# EAGLE design matemat (EAGLE 5.10)
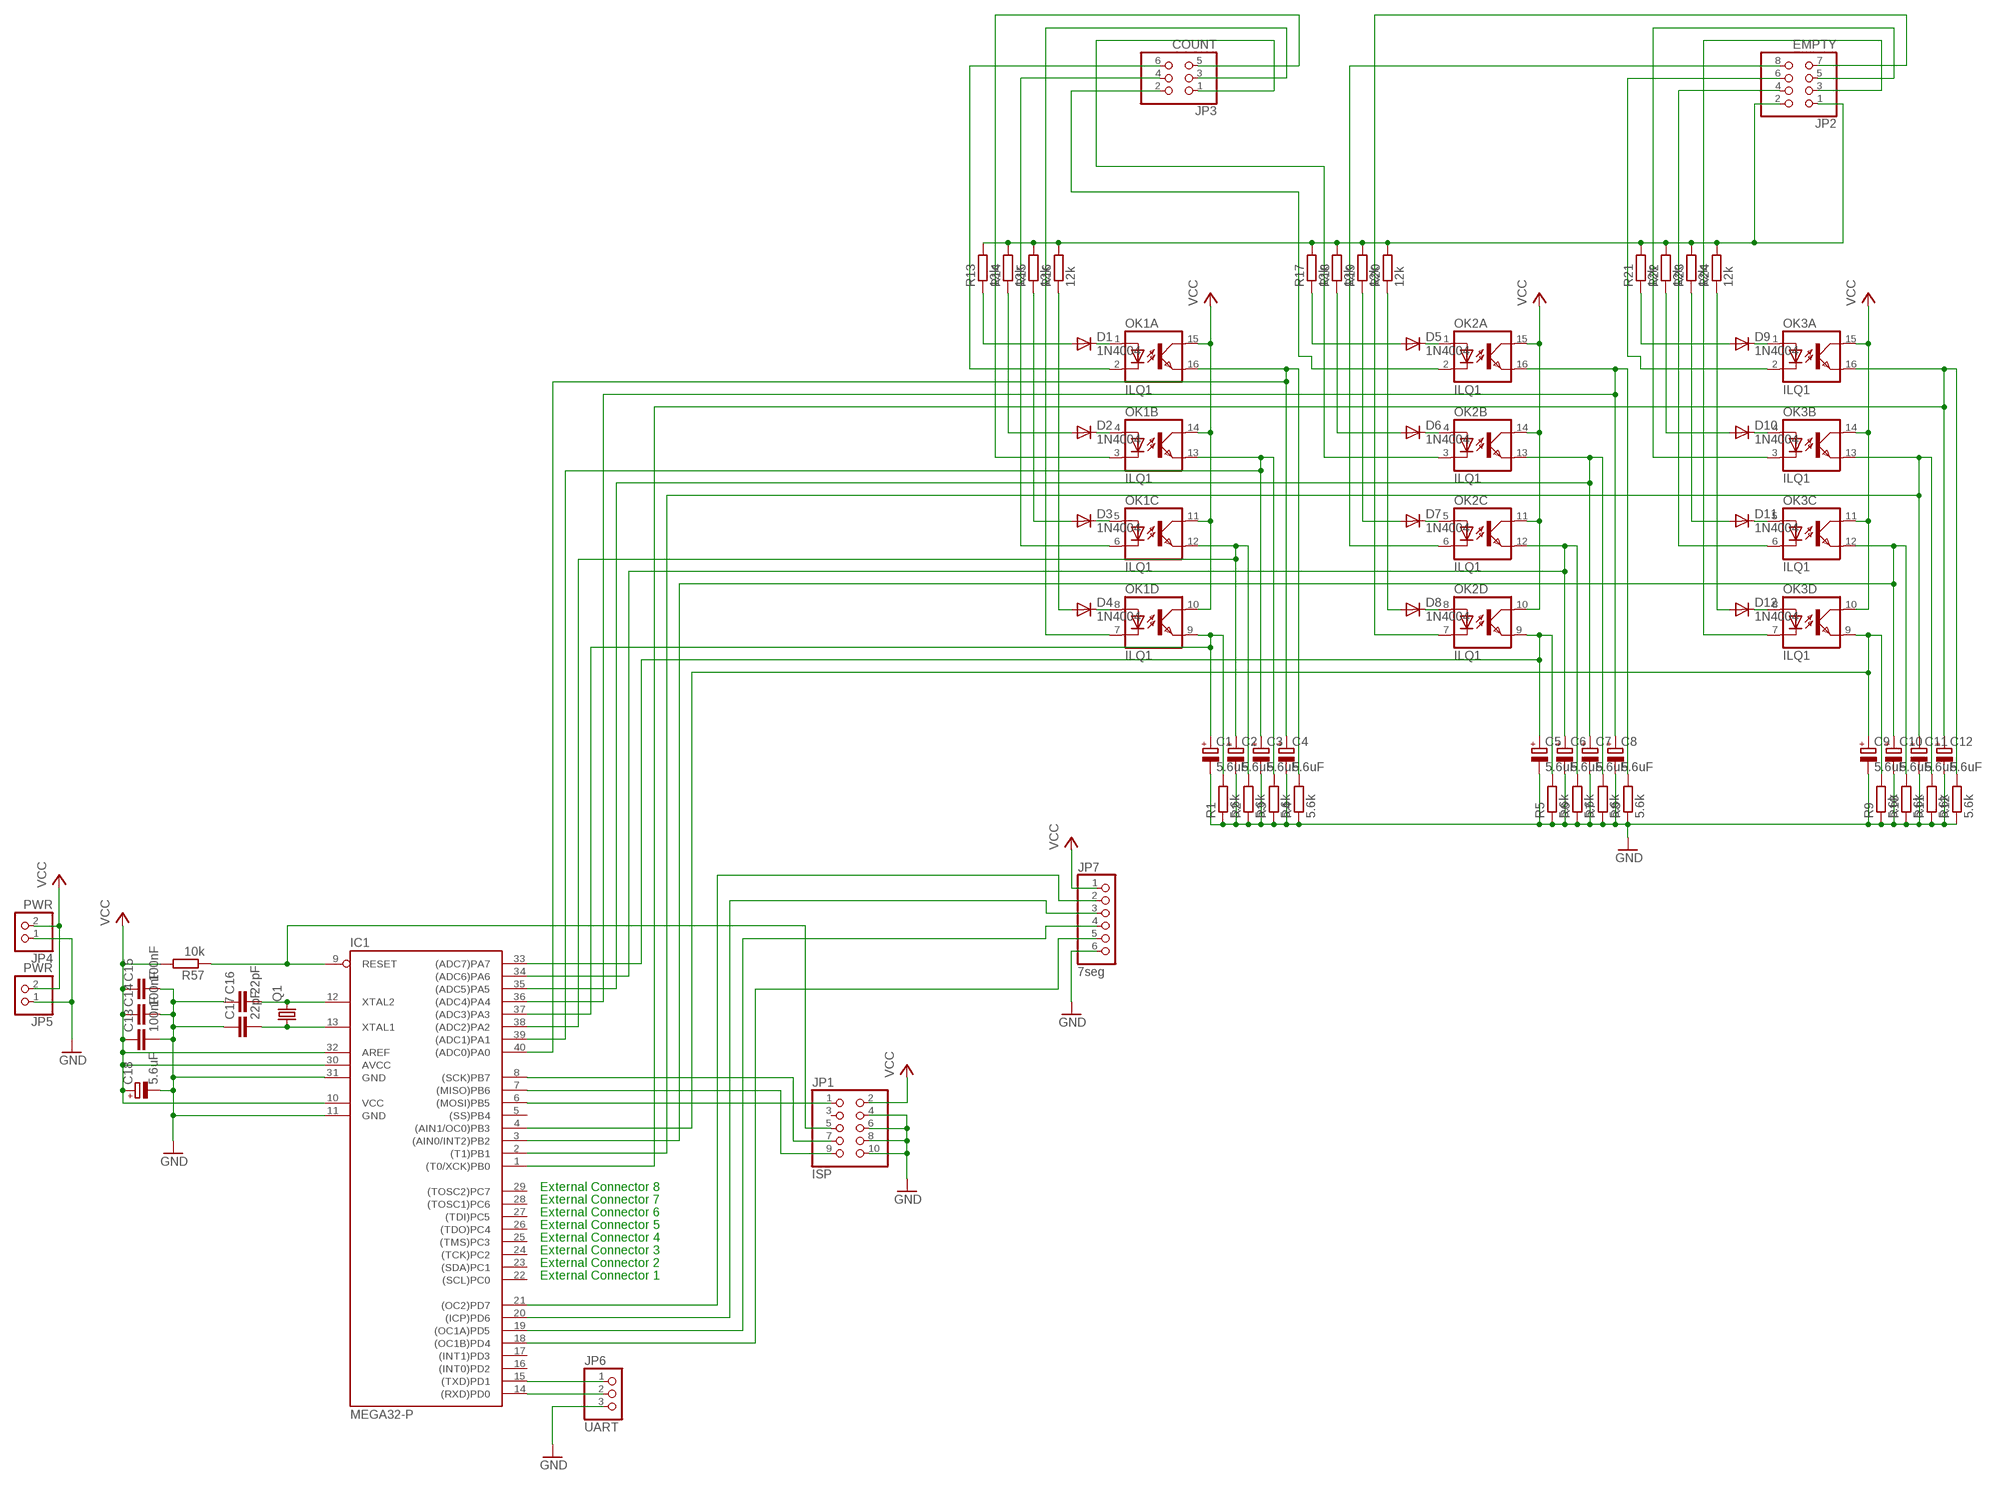
[diagram p0: schematic, sheet 1]

## Parts
C1  5.6uF  CPOL-EU153CLV-0807  [153CLV-0807]
C2  5.6uF  CPOL-EU153CLV-0807  [153CLV-0807]
C3  5.6uF  CPOL-EU153CLV-0807  [153CLV-0807]
C4  5.6uF  CPOL-EU153CLV-0807  [153CLV-0807]
C5  5.6uF  CPOL-EU153CLV-0807  [153CLV-0807]
C6  5.6uF  CPOL-EU153CLV-0807  [153CLV-0807]
C7  5.6uF  CPOL-EU153CLV-0807  [153CLV-0807]
C8  5.6uF  CPOL-EU153CLV-0807  [153CLV-0807]
C9  5.6uF  CPOL-EU153CLV-0807  [153CLV-0807]
C10  5.6uF  CPOL-EU153CLV-0807  [153CLV-0807]
C11  5.6uF  CPOL-EU153CLV-0807  [153CLV-0807]
C12  5.6uF  CPOL-EU153CLV-0807  [153CLV-0807]
C13  100nF  C-EUC0603  [C0603]
C14  100nF  C-EUC0603  [C0603]
C15  100nF  C-EUC0603  [C0603]
C16  22pF  C-EUC0603  [C0603]
C17  22pF  C-EUC0603  [C0603]
C18  5.6uF  CPOL-EU153CLV-0807  [153CLV-0807]
D1  1N4004  [DO41-10]
D2  1N4004  [DO41-10]
D3  1N4004  [DO41-10]
D4  1N4004  [DO41-10]
D5  1N4004  [DO41-10]
D6  1N4004  [DO41-10]
D7  1N4004  [DO41-10]
D8  1N4004  [DO41-10]
D9  1N4004  [DO41-10]
D10  1N4004  [DO41-10]
D11  1N4004  [DO41-10]
D12  1N4004  [DO41-10]
IC1  MEGA32-P  [DIL40]
JP1  ISP  PINHD-2X5  [2X05]
JP2  EMPTY  PINHD-2X4/90  [2X04/90]
JP3  COUNT  PINHD-2X3/90  [2X03/90]
JP4  PWR  PINHD-1X2/90  [1X02/90]
JP5  PWR  PINHD-1X2/90  [1X02/90]
JP6  UART  PINHD-1X3/90  [1X03/90]
JP7  7seg  PINHD-1X6/90  [1X06/90]
OK1  ILQ1  [DIL16]
OK2  ILQ1  [DIL16]
OK3  ILQ1  [DIL16]
Q1  CRYSTALSM49  [SM49]
R1  5.6k  R-EU_R0603  [R0603]
R2  5.6k  R-EU_R0603  [R0603]
R3  5.6k  R-EU_R0603  [R0603]
R4  5.6k  R-EU_R0603  [R0603]
R5  5.6k  R-EU_R0603  [R0603]
R6  5.6k  R-EU_R0603  [R0603]
R7  5.6k  R-EU_R0603  [R0603]
R8  5.6k  R-EU_R0603  [R0603]
R9  5.6k  R-EU_R0603  [R0603]
R10  5.6k  R-EU_R0603  [R0603]
R11  5.6k  R-EU_R0603  [R0603]
R12  5.6k  R-EU_R0603  [R0603]
R13  12k  R-EU_R0603  [R0603]
R14  12k  R-EU_R0603  [R0603]
R15  12k  R-EU_R0603  [R0603]
R16  12k  R-EU_R0603  [R0603]
R17  12k  R-EU_R0603  [R0603]
R18  12k  R-EU_R0603  [R0603]
R19  12k  R-EU_R0603  [R0603]
R20  12k  R-EU_R0603  [R0603]
R21  12k  R-EU_R0603  [R0603]
R22  12k  R-EU_R0603  [R0603]
R23  12k  R-EU_R0603  [R0603]
R24  12k  R-EU_R0603  [R0603]
R57  10k  R-EU_R0603  [R0603]

## Nets
GND: C1.- C2.- C3.- C4.- C5.- C6.- C7.- C8.- C9.- C10.- C11.- C12.- C13.2 C14.2 C15.2 C16.1 C17.1 C18.- IC1.11(GND) IC1.31(GND) JP1.4 JP1.6 JP1.8 JP1.10 JP4.1 JP5.1 JP6.3 JP7.6 R1.1 R2.1 R3.1 R4.1 R5.1 R6.1 R7.1 R8.1 R9.1 R10.1 R11.1 R12.1
N$1: C1.+ IC1.37((ADC3)PA3) OK1.9(D:EMIT) R1.2
N$2: JP3.3 OK1.7(D:C)
N$3: C2.+ IC1.38((ADC2)PA2) OK1.12(C:EMIT) R2.2
N$5: C4.+ IC1.40((ADC0)PA0) OK1.16(A:EMIT) R4.2
N$6: C5.+ IC1.33((ADC7)PA7) OK2.9(D:EMIT) R5.2
N$7: C6.+ IC1.34((ADC6)PA6) OK2.12(C:EMIT) R6.2
N$8: C7.+ IC1.35((ADC5)PA5) OK2.13(B:EMIT) R7.2
N$9: C8.+ IC1.36((ADC4)PA4) OK2.16(A:EMIT) R8.2
N$10: C9.+ IC1.4((AIN1/OC0)PB3) OK3.9(D:EMIT) R9.2
N$11: C10.+ IC1.3((AIN0/INT2)PB2) OK3.12(C:EMIT) R10.2
N$12: C11.+ IC1.2((T1)PB1) OK3.13(B:EMIT) R11.2
N$13: C12.+ IC1.1((T0/XCK)PB0) OK3.16(A:EMIT) R12.2
N$14: D1.C OK1.1(A:A)
N$15: D2.C OK1.4(B:A)
N$16: D3.C OK1.5(C:A)
N$17: D4.C OK1.8(D:A)
N$18: D8.C OK2.8(D:A)
N$19: D7.C OK2.5(C:A)
N$20: D6.C OK2.4(B:A)
N$21: D5.C OK2.1(A:A)
N$22: D9.C OK3.1(A:A)
N$23: D10.C OK3.4(B:A)
N$24: D11.C OK3.5(C:A)
N$25: D12.C OK3.8(D:A)
N$26: D9.A R21.1
N$27: D10.A R22.1
N$28: D11.A R23.1
N$29: D12.A R24.1
N$30: D5.A R17.1
N$31: D6.A R18.1
N$32: D7.A R19.1
N$33: D8.A R20.1
N$34: D1.A R13.1
N$35: D2.A R14.1
N$36: D3.A R15.1
N$37: D4.A R16.1
N$38: JP2.1 JP2.2 R13.2 R14.2 R15.2 R16.2 R17.2 R18.2 R19.2 R20.2 R21.2 R22.2 R23.2 R24.2
N$39: JP3.4 OK1.6(C:C)
N$40: JP3.5 OK1.3(B:C)
N$41: JP3.6 OK1.2(A:C)
N$42: JP2.7 OK2.7(D:C)
N$43: JP2.8 OK2.6(C:C)
N$44: JP3.1 OK2.3(B:C)
N$45: JP3.2 OK2.2(A:C)
N$46: JP2.3 OK3.7(D:C)
N$47: JP2.4 OK3.6(C:C)
N$48: JP2.5 OK3.3(B:C)
N$49: JP2.6 OK3.2(A:C)
N$51: C3.+ IC1.39((ADC1)PA1) OK1.13(B:EMIT) R3.2
N$118: IC1.21((OC2)PD7) JP7.2
N$119: IC1.9(RESET) JP1.5 R57.1
N$120: IC1.20((ICP)PD6) JP7.3
N$121: C16.2 IC1.12(XTAL2) Q1.2
N$122: C17.2 IC1.13(XTAL1) Q1.1
N$123: IC1.6((MOSI)PB5) JP1.1
N$124: IC1.19((OC1A)PD5) JP7.4
N$125: IC1.18((OC1B)PD4) JP7.5
N$126: IC1.7((MISO)PB6) JP1.9
N$127: IC1.8((SCK)PB7) JP1.7
N$133: IC1.15((TXD)PD1) JP6.1
N$134: IC1.14((RXD)PD0) JP6.2
VCC: C13.1 C14.1 C15.1 C18.+ IC1.10(VCC) IC1.30(AVCC) IC1.32(AREF) JP1.2 JP4.2 JP5.2 JP7.1 OK1.10(D:COL) OK1.11(C:COL) OK1.14(B:COL) OK1.15(A:COL) OK2.10(D:COL) OK2.11(C:COL) OK2.14(B:COL) OK2.15(A:COL) OK3.10(D:COL) OK3.11(C:COL) OK3.14(B:COL) OK3.15(A:COL) R57.2
Unconnected: IC1.5((SS)PB4) IC1.16((INT0)PD2) IC1.17((INT1)PD3) IC1.22((SCL)PC0) IC1.23((SDA)PC1) IC1.24((TCK)PC2) IC1.25((TMS)PC3) IC1.26((TDO)PC4) IC1.27((TDI)PC5) IC1.28((TOSC1)PC6) IC1.29((TOSC2)PC7) JP1.3

## Notes on the sheet
- External Connector 8
- External Connector 7
- External Connector 6
- External Connector 5
- External Connector 4
- External Connector 3
- External Connector 2
- External Connector 1

## Library data of the parts
C1-C12 C18 = rcl:CPOL-EU: POLARIZED CAPACITOR, European symbol
C13-C17 = rcl:C-EU: CAPACITOR, European symbol
D1-D12 = diode:1N4004: DIODE general purpose rectifier, 1 A
IC1 = atmel:MEGA32-P: MICROCONTROLLER 32 Kbytes FLASH 2 Kbytes SRAM 1 Kbytes EEPROM USART 8-channel 10 bit ADC Source: www.atmel.com .. doc2503.pdf
JP1 = pinhead:PINHD-2X5: PIN HEADER
JP2 = pinhead:PINHD-2X4: PIN HEADER
JP3 = pinhead:PINHD-2X3: PIN HEADER
JP4 JP5 = pinhead:PINHD-1X2: PIN HEADER
JP6 = pinhead:PINHD-1X3: PIN HEADER
JP7 = pinhead:PINHD-1X6: PIN HEADER
OK1-OK3 = optocoupler:ILQ1: SIEMENS OPTO COUPLER
Q1 = crystal:CRYSTAL: CRYSTAL
R1-R24 R57 = rcl:R-EU_: RESISTOR, European symbol

## Board
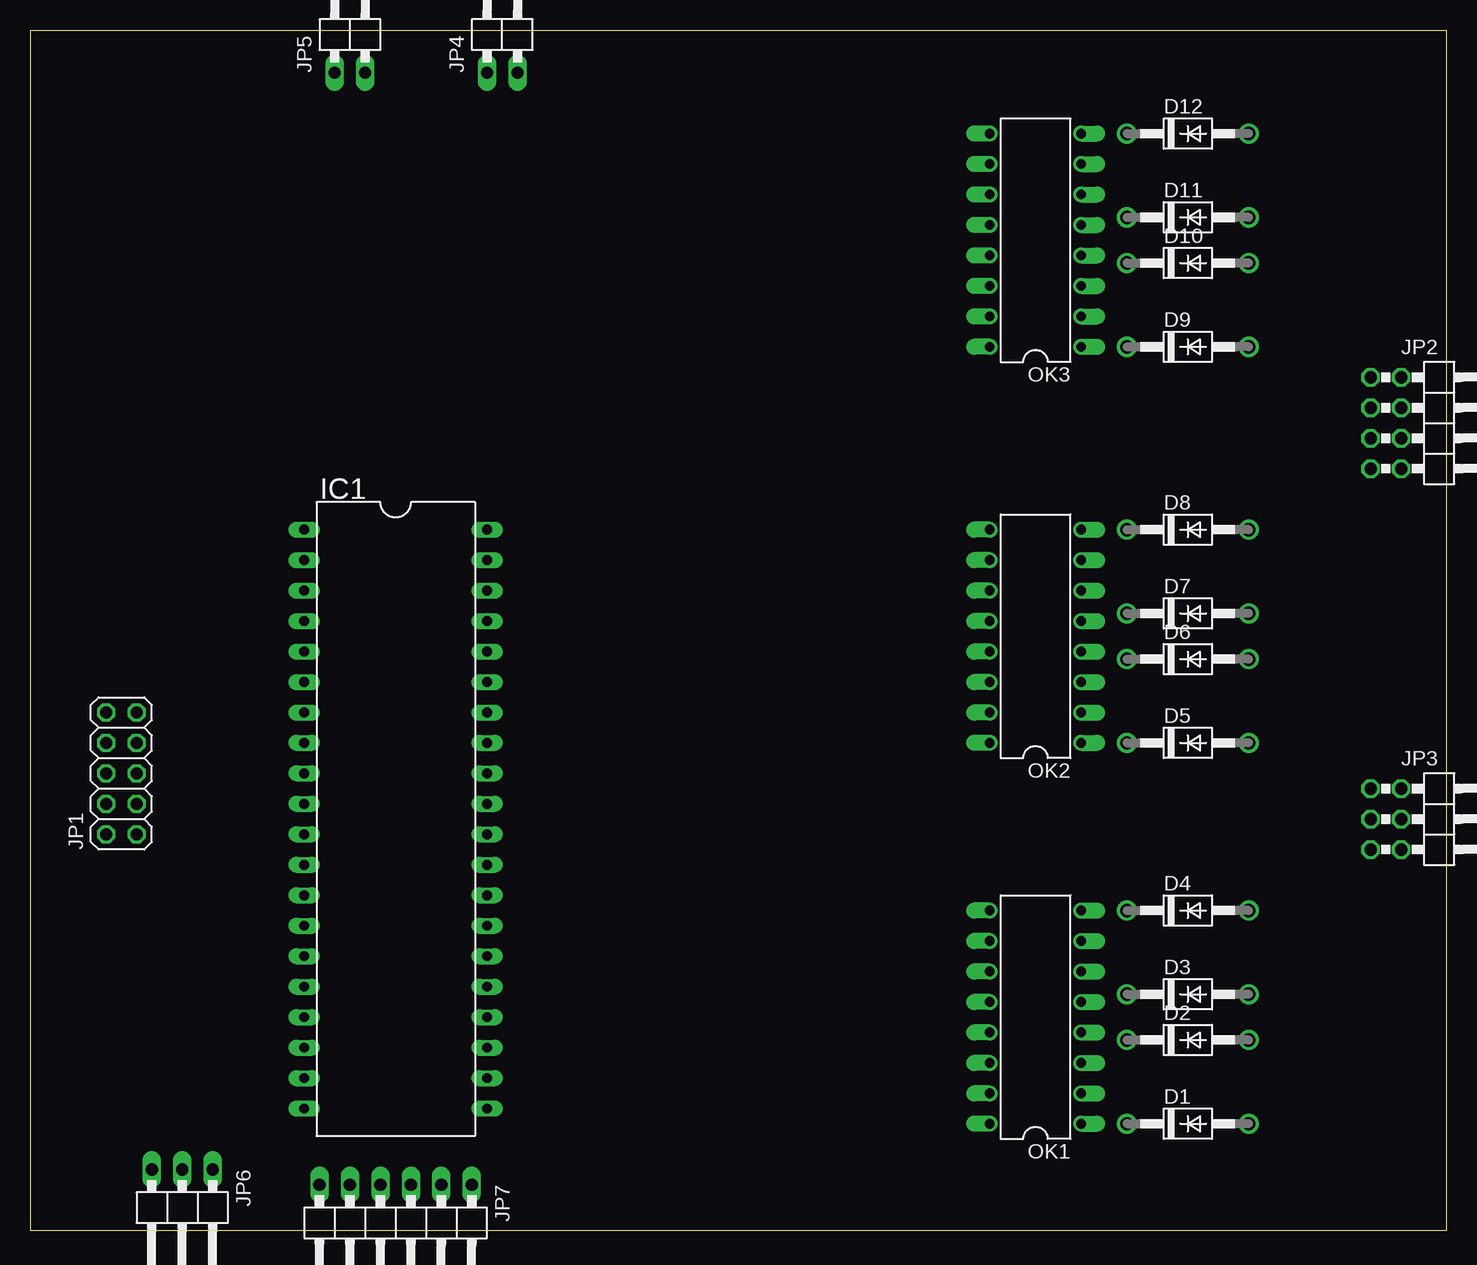
[diagram p1: board, top side]
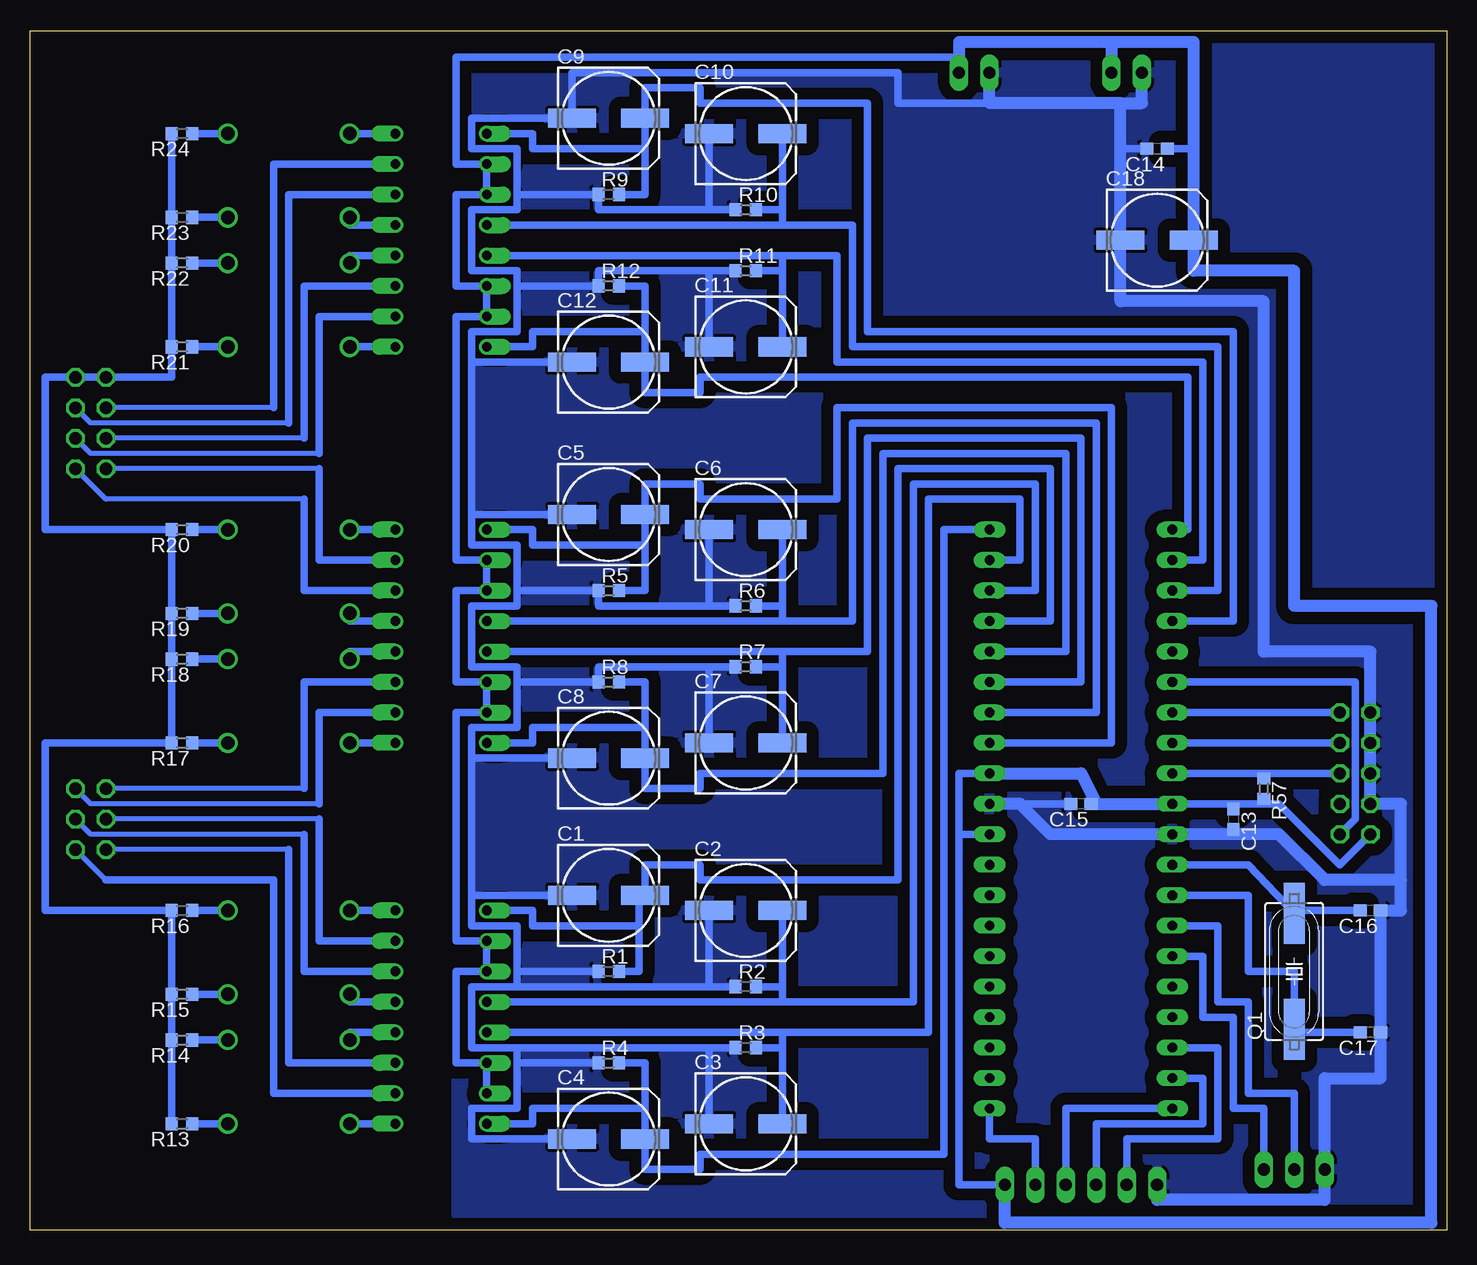
[diagram p2: board, bottom side, seen from below]

Size 118.09 x 100 mm. Coordinates in mm from the lower left corner, seen from the top.
Outline: 0,0 118.09,0 118.09,100 0,100 0,0
Copper layers (1*16): Top 0.035mm / dielectric 1.5mm / Bottom 0.035mm
Design rules "default": minimum track width 10mil, minimum drill 24mil, track to track 8mil, track to pad 8mil, pad to pad 8mil, via to via 8mil, smd to smd 8mil, copper to edge 40mil, drill to drill 8mil, minimum pad ring 10mil, minimum via ring 8mil, stop-mask expansion 4mil, vias tented up to drill 0mil, thermal gap 10mil

### Footprints (pad centres in the part's own frame; a part is rotated, then mirrored left to right if it is on the bottom)
153CLV-0807 = smd 4 x 1.6: + 3.05,0; - -3.05,0
C0603 = smd 1.1 x 1: 1 -0.85,0; 2 0.85,0
DO41-10 = drill 1.118 round: A 5.08,0; C -5.08,0
DIL40 = drill 0.813 long: 1 -24.13,-7.62; 2 -21.59,-7.62; 3 -19.05,-7.62; 4 -16.51,-7.62; 5 -13.97,-7.62; 6 -11.43,-7.62; 7 -8.89,-7.62; 8 -6.35,-7.62; 9 -3.81,-7.62; 10 -1.27,-7.62; 11 1.27,-7.62; 12 3.81,-7.62; 13 6.35,-7.62; 14 8.89,-7.62; 15 11.43,-7.62; 16 13.97,-7.62; 17 16.51,-7.62; 18 19.05,-7.62; 19 21.59,-7.62; 20 24.13,-7.62; 21 24.13,7.62; 22 21.59,7.62; 23 19.05,7.62; 24 16.51,7.62; 25 13.97,7.62; 26 11.43,7.62; 27 8.89,7.62; 28 6.35,7.62; 29 3.81,7.62; 30 1.27,7.62; 31 -1.27,7.62; 32 -3.81,7.62; 33 -6.35,7.62; 34 -8.89,7.62; 35 -11.43,7.62; 36 -13.97,7.62; 37 -16.51,7.62; 38 -19.05,7.62; 39 -21.59,7.62; 40 -24.13,7.62
2X05 = drill 1.016 octagon: 1 -5.08,-1.27; 2 -5.08,1.27; 3 -2.54,-1.27; 4 -2.54,1.27; 5 0,-1.27; 6 0,1.27; 7 2.54,-1.27; 8 2.54,1.27; 9 5.08,-1.27; 10 5.08,1.27
2X04/90 = drill 1.016 octagon: 1 -3.81,-6.35; 2 -3.81,-3.81; 3 -1.27,-6.35; 4 -1.27,-3.81; 5 1.27,-6.35; 6 1.27,-3.81; 7 3.81,-6.35; 8 3.81,-3.81
2X03/90 = drill 1.016 octagon: 1 -2.54,-6.35; 2 -2.54,-3.81; 3 0,-6.35; 4 0,-3.81; 5 2.54,-6.35; 6 2.54,-3.81
1X02/90 = drill 1.016 long: 1 -1.27,-3.81; 2 1.27,-3.81
1X03/90 = drill 1.016 long: 1 -2.54,-3.81; 2 0,-3.81; 3 2.54,-3.81
1X06/90 = drill 1.016 long: 1 -6.35,-3.81; 2 -3.81,-3.81; 3 -1.27,-3.81; 4 1.27,-3.81; 5 3.81,-3.81; 6 6.35,-3.81
DIL16 = drill 0.813 offset: 1 -8.89,-3.81; 2 -6.35,-3.81; 3 -3.81,-3.81; 4 -1.27,-3.81; 5 1.27,-3.81; 6 3.81,-3.81; 7 6.35,-3.81; 8 8.89,-3.81; 9 8.89,3.81; 10 6.35,3.81; 11 3.81,3.81; 12 1.27,3.81; 13 -1.27,3.81; 14 -3.81,3.81; 15 -6.35,3.81; 16 -8.89,3.81
SM49 = smd 5.08 x 1.778: 1 -4.826,0; 2 4.826,0
R0603 = smd 1 x 1.1: 1 -0.85,0; 2 0.85,0

### Placement (x,y rotation side)
C1  69.85,27.94 0 bottom
C2  58.42,26.67 0 bottom
C3  58.42,8.89 0 bottom
C4  69.85,7.62 0 bottom
C5  69.85,59.69 0 bottom
C6  58.42,58.42 0 bottom
C7  58.42,40.64 0 bottom
C8  69.85,39.37 0 bottom
C9  69.85,92.71 0 bottom
C10  58.42,91.44 0 bottom
C11  58.42,73.66 0 bottom
C12  69.85,72.39 0 bottom
C13  17.78,34.29 270 bottom
C14  24.13,90.17 180 bottom
C15  30.48,35.56 180 bottom
C16  6.35,26.67 180 bottom
C17  6.35,16.51 180 bottom
C18  24.13,82.55 0 bottom
D1  96.52,8.89 0 top
D2  96.52,15.88 0 top
D3  96.52,19.68 0 top
D4  96.52,26.67 0 top
D5  96.52,40.64 0 top
D6  96.52,47.62 0 top
D7  96.52,51.44 0 top
D8  96.52,58.42 0 top
D9  96.52,73.66 0 top
D10  96.52,80.64 0 top
D11  96.52,84.45 0 top
D12  96.52,91.44 0 top
IC1  30.48,34.29 270 top
JP1  7.62,38.1 90 top
JP2  118.11,67.31 270 top
JP3  118.11,34.29 270 top
JP4  39.37,100.33 0 top
JP5  26.67,100.33 0 top
JP6  12.7,1.27 180 top
JP7  30.48,0 180 top
OK1  83.82,17.78 90 top
OK2  83.82,49.53 90 top
OK3  83.82,82.55 90 top
Q1  12.7,21.59 90 bottom
R1  69.85,21.59 0 bottom
R2  58.42,20.32 0 bottom
R3  58.42,15.24 0 bottom
R4  69.85,13.97 0 bottom
R5  69.85,53.34 0 bottom
R6  58.42,52.07 0 bottom
R7  58.42,46.99 0 bottom
R8  69.85,45.72 0 bottom
R9  69.85,86.36 0 bottom
R10  58.42,85.09 0 bottom
R11  58.42,80.01 0 bottom
R12  69.85,78.74 0 bottom
R13  105.41,8.89 180 bottom
R14  105.41,15.88 180 bottom
R15  105.41,19.68 180 bottom
R16  105.41,26.67 180 bottom
R17  105.41,40.64 180 bottom
R18  105.41,47.62 180 bottom
R19  105.41,51.44 180 bottom
R20  105.41,58.42 180 bottom
R21  105.41,73.66 180 bottom
R22  105.41,80.64 180 bottom
R23  105.41,84.45 180 bottom
R24  105.41,91.44 180 bottom
R57  15.24,36.83 270 bottom

### Tracks (layer width: path | path; a pad name or v marks a point on that pad's centre or on a via)
GND
  Bottom 0.61: 81.28,27.94 81.28,25.4 77.47,25.4 77.47,21.59 | C4.- 81.28,7.62 81.28,10.16 77.47,10.16 77.47,13.97 | 77.47,13.97 R4.1 | 77.47,21.59 R1.1 | 77.47,21.59 77.47,20.32 | 77.47,20.32 81.28,20.32 81.28,15.24 77.47,15.24 | 77.47,15.24 77.47,13.97 | 61.47,20.32 R2.1 | 61.47,20.32 C2.- | 77.47,20.32 61.47,20.32 | 61.47,15.24 C3.- | 61.47,15.24 R3.1 | 77.47,15.24 61.47,15.24 | 81.28,59.69 81.28,57.15 77.47,57.15 77.47,53.34 | 77.47,53.34 R5.1 70.7,52.07 61.47,52.07 | 81.28,39.37 C8.- | 81.28,39.37 81.28,41.91 77.47,41.91 77.47,45.72 | 77.47,45.72 R8.1 70.7,46.99 R7.1 61.47,46.99 C7.- | 77.47,45.72 77.47,46.99 81.28,46.99 81.28,52.07 77.47,52.07 77.47,53.34 | 61.47,52.07 C6.- | 61.47,52.07 R6.1 | 81.28,27.94 C1.- | 81.28,39.37 81.28,27.94 | 81.28,72.39 C12.- | 81.28,72.39 81.28,74.93 77.47,74.93 77.47,78.74 | 77.47,78.74 77.47,80.01 81.28,80.01 81.28,85.09 77.47,85.09 77.47,86.36 | 77.47,86.36 77.47,90.17 81.28,90.17 81.28,92.71 C9.- 72.9,96.52 45.72,96.52 45.72,93.98 38.1,93.98 | 61.47,85.09 C10.- | 61.47,85.09 R10.1 | C11.- 61.47,80.01 R11.1 70.7,80.01 R12.1 77.47,78.74 | 77.47,86.36 R9.1 70.7,85.09 61.47,85.09 | 81.28,59.69 C5.- | 81.28,72.39 81.28,59.69 | 35.56,35.56 C15.2 | 27.18,90.17 C14.2
  Bottom 1.016: IC1.31 35.56,35.56 33.02,33.02 IC1.11 17.78,33.02 | JP7.6 24.13,2.54 10.16,2.54 JP6.3 10.16,12.7 5.5,12.7 C17.1 C16.1 3.81,26.67 3.81,29.21 | JP4.1 38.1,93.98 27.18,93.98 | 3.81,29.21 10.16,29.21 13.97,33.02 17.78,33.02 | 3.81,29.21 3.81,35.56 JP1.4 JP1.6 JP1.8 JP1.10 6.35,48.26 15.24,48.26 15.24,77.47 27.18,77.47 C18.- 27.18,90.17 27.18,93.98 | JP5.1 25.4,93.98 27.18,93.98 | 17.78,33.02 C13.2
  pour Bottom (isolate 1.016): 1.27,1.27 1.27,99.06 82.55,99.06 82.55,1.27
N$1
  Bottom 0.61: IC1.37 33.02,50.8 33.02,63.5 45.72,63.5 45.72,29.21 62.23,29.21 62.23,30.48 66.8,30.48 C1.+ 67.31,27.94 67.31,25.4 | OK1.9 76.2,26.67 76.2,25.4 67.31,25.4 | 67.31,25.4 67.31,21.59 R1.2
N$2
  Bottom 0.406: 93.98,34.29 JP3.3
  Bottom 0.61: OK1.7 93.98,24.13 93.98,34.29
N$3
  Bottom 0.61: IC1.38 34.29,53.34 34.29,62.23 44.45,62.23 44.45,19.05 55.37,19.05 | 55.37,19.05 55.37,20.32 | 55.37,20.32 R2.2 | 55.37,20.32 C2.+ | 55.37,19.05 OK1.12
N$5
  Bottom 0.61: 66.8,10.16 C4.+ 66.8,5.08 62.23,5.08 62.23,6.35 41.91,6.35 41.91,58.42 IC1.40 | OK1.16 76.2,8.89 76.2,10.16 66.8,10.16 | 66.8,10.16 66.8,13.97 R4.2
N$6
  Bottom 0.61: IC1.33 27.94,40.64 27.94,68.58 50.8,68.58 50.8,60.96 62.23,60.96 62.23,62.23 66.8,62.23 C5.+ 66.8,57.15 | 66.8,57.15 66.8,53.34 R5.2 | OK2.9 76.2,58.42 76.2,57.15 66.8,57.15
N$7
  Bottom 0.61: IC1.34 29.21,43.18 29.21,67.31 49.53,67.31 49.53,50.8 55.37,50.8 | R6.2 55.37,52.07 C6.+ 55.37,50.8 | 55.37,50.8 OK2.12
N$8
  Bottom 0.61: IC1.35 30.48,45.72 30.48,66.04 48.26,66.04 48.26,48.26 55.37,48.26 | 55.37,46.99 C7.+ | 55.37,46.99 R7.2 | 55.37,48.26 55.37,46.99 | 55.37,48.26 OK2.13
N$9
  Bottom 0.61: IC1.36 31.75,48.26 31.75,64.77 46.99,64.77 46.99,38.1 62.23,38.1 62.23,36.83 66.8,36.83 C8.+ 66.8,41.91 | 66.8,41.91 66.8,45.72 R8.2 | OK2.16 76.2,40.64 76.2,41.91 66.8,41.91
N$10
  Bottom 0.61: 66.8,90.17 66.8,86.36 R9.2 | 66.8,90.17 C9.+ 66.8,95.25 62.23,95.25 62.23,93.98 48.26,93.98 48.26,74.93 17.78,74.93 17.78,50.8 IC1.4 | OK3.9 76.2,91.44 76.2,90.17 66.8,90.17
N$11
  Bottom 0.61: 55.37,85.09 C10.+ | 55.37,85.09 R10.2 | 55.37,83.82 OK3.12 | 55.37,83.82 55.37,85.09 | 55.37,83.82 49.53,83.82 49.53,73.66 19.05,73.66 19.05,53.34 IC1.3
N$12
  Bottom 0.61: 55.37,80.01 C11.+ | 55.37,80.01 R11.2 | 55.37,81.28 OK3.13 | 55.37,81.28 55.37,80.01 | IC1.2 20.32,55.88 20.32,72.39 50.8,72.39 50.8,81.28 55.37,81.28
N$13
  Bottom 0.61: 66.8,74.93 C12.+ 66.8,69.85 62.23,69.85 62.23,71.12 21.59,71.12 21.59,58.42 IC1.1 | 66.8,74.93 66.8,78.74 R12.2 | OK3.16 76.2,73.66 76.2,74.93 66.8,74.93
N$14
  Bottom 0.61: OK1.1 D1.C
N$15
  Bottom 0.61: OK1.4 91.44,16.51 D2.C
N$16
  Bottom 0.61: OK1.5 91.44,19.05 D3.C
N$17
  Bottom 0.61: OK1.8 D4.C
N$18
  Bottom 0.61: OK2.8 D8.C
N$19
  Bottom 0.61: OK2.5 91.44,50.8 D7.C
N$20
  Bottom 0.61: OK2.4 91.44,48.26 D6.C
N$21
  Bottom 0.61: OK2.1 D5.C
N$22
  Bottom 0.61: OK3.1 D9.C
N$23
  Bottom 0.61: OK3.4 91.44,81.28 D10.C
N$24
  Bottom 0.61: OK3.5 91.44,83.82 D11.C
N$25
  Bottom 0.61: OK3.8 D12.C
N$26
  Bottom 0.61: D9.A R21.1
N$27
  Bottom 0.61: D10.A R22.1
N$28
  Bottom 0.61: D11.A R23.1
N$29
  Bottom 0.61: D12.A R24.1
N$30
  Bottom 0.61: D5.A R17.1
N$31
  Bottom 0.61: D6.A R18.1
N$32
  Bottom 0.61: D7.A R19.1
N$33
  Bottom 0.61: D8.A R20.1
N$34
  Bottom 0.61: D1.A R13.1
N$35
  Bottom 0.61: D2.A R14.1
N$36
  Bottom 0.61: D3.A R15.1
N$37
  Bottom 0.61: D4.A R16.1
N$38
  Bottom 0.61: R13.2 R14.2 R15.2 R16.2 116.84,26.67 116.84,40.64 R17.2 R18.2 R19.2 R20.2 116.84,58.42 116.84,71.12 JP2.2 JP2.1 106.26,71.12 R21.2 R22.2 R23.2 R24.2
N$39
  Bottom 0.406: JP3.4 113.03,33.02 95.25,33.02
  Bottom 0.61: 95.25,33.02 95.25,21.59 OK1.6
N$40
  Bottom 0.406: 96.52,31.75 JP3.5
  Bottom 0.61: OK1.3 96.52,13.97 96.52,31.75
N$41
  Bottom 0.406: 111.76,29.21 JP3.6
  Bottom 0.61: 111.76,29.21 97.79,29.21 97.79,11.43 OK1.2
N$42
  Bottom 0.406: 93.98,63.5 JP2.7
  Bottom 0.61: OK2.7 93.98,55.88 93.98,63.5
N$43
  Bottom 0.406: 95.25,60.96 111.76,60.96 JP2.8
  Bottom 0.61: OK2.6 95.25,53.34 95.25,60.96
N$44
  Bottom 0.406: 95.25,36.83 JP3.1
  Bottom 0.61: 95.25,36.83 95.25,45.72 OK2.3
N$45
  Bottom 0.406: 93.98,35.56 113.03,35.56 JP3.2
  Bottom 0.61: OK2.2 93.98,43.18 93.98,35.56
N$46
  Bottom 0.406: 97.79,68.58 JP2.3
  Bottom 0.61: OK3.7 97.79,88.9 97.79,68.58
N$47
  Bottom 0.406: 96.52,67.31 113.03,67.31 JP2.4
  Bottom 0.61: OK3.6 96.52,86.36 96.52,67.31
N$48
  Bottom 0.406: 95.25,66.04 JP2.5
  Bottom 0.61: OK3.3 95.25,78.74 95.25,66.04
N$49
  Bottom 0.406: 93.98,64.77 113.03,64.77 JP2.6
  Bottom 0.61: OK3.2 93.98,76.2 93.98,64.77
N$51
  Bottom 0.61: IC1.39 35.56,55.88 35.56,60.96 43.18,60.96 43.18,16.51 55.37,16.51 | 55.37,15.24 C3.+ | 55.37,16.51 55.37,15.24 | 55.37,16.51 OK1.13 | 55.37,15.24 R3.2
N$118
  Bottom 0.61: IC1.21 38.1,7.62 34.29,7.62 JP7.2
N$119
  Bottom 0.61: 15.24,38.1 IC1.9 | JP1.5 15.24,38.1 | 15.24,38.1 R57.1
N$120
  Bottom 0.61: IC1.20 31.75,10.16 JP7.3
N$121
  Bottom 0.61: IC1.12 16.51,30.48 Q1.2 12.7,26.67 C16.2
N$122
  Bottom 0.61: C17.2 12.7,16.51 Q1.1 12.7,21.59 16.51,21.59 16.51,27.94 IC1.13
N$123
  Bottom 0.61: IC1.6 7.62,45.72 7.62,34.29 JP1.1
N$124
  Bottom 0.61: IC1.19 20.32,12.7 20.32,8.89 29.21,8.89 JP7.4
N$125
  Bottom 0.61: IC1.18 19.05,15.24 19.05,7.62 26.67,7.62 JP7.5
N$126
  Bottom 0.61: JP1.9 IC1.7
N$127
  Bottom 0.61: JP1.7 IC1.8
N$133
  Bottom 0.61: IC1.15 20.32,22.86 20.32,17.78 17.78,17.78 17.78,10.16 15.24,10.16 JP6.1
N$134
  Bottom 0.61: IC1.14 19.05,25.4 19.05,19.05 16.51,19.05 16.51,11.43 12.7,11.43 JP6.2
VCC
  Bottom 0.61: OK1.15 OK1.14 82.55,13.97 82.55,21.59 OK1.11 OK1.10 82.55,24.13 82.55,43.18 OK2.15 OK2.14 82.55,45.72 82.55,53.34 OK2.11 OK2.10 82.55,55.88 82.55,76.2 OK3.15 OK3.14 82.55,78.74 82.55,86.36 OK3.11 OK3.10 82.55,88.9 82.55,97.79 40.64,97.79 JP4.2 | 29.21,35.56 C15.1 | IC1.10 18.2,35.56 | 18.2,35.56 C13.1 | 18.2,35.56 15.66,35.56 | 15.66,35.56 R57.2 | JP1.2 8.89,30.48 13.97,35.56 15.66,35.56 | JP7.1 40.64,3.81 40.64,33.02 | 40.64,33.02 IC1.30 | 40.64,33.02 40.64,38.1 IC1.32 | 21.08,90.17 C14.1
  Bottom 1.016: IC1.32 30.48,38.1 29.21,35.56 IC1.10 | 27.94,99.06 40.64,99.06 JP4.2 | 27.94,99.06 JP5.2 | JP7.1 36.83,0.64 1.27,0.64 1.27,52.07 12.7,52.07 12.7,80.01 21.08,80.01 C18.+ 21.08,90.17 21.08,99.06 27.94,99.06